# Altium schematic sheet Analog Interface.SchDoc
size A4; Author: Esteban Durán Madrid; CompanyName: Universidad de Santiago de Chile; Address1: Avenida Ecuador Nº 3519; Address2: Estación Central, Santiago; Address3: Chile; DocumentNumber: 4; SheetNumber: 4; SheetTotal: 5
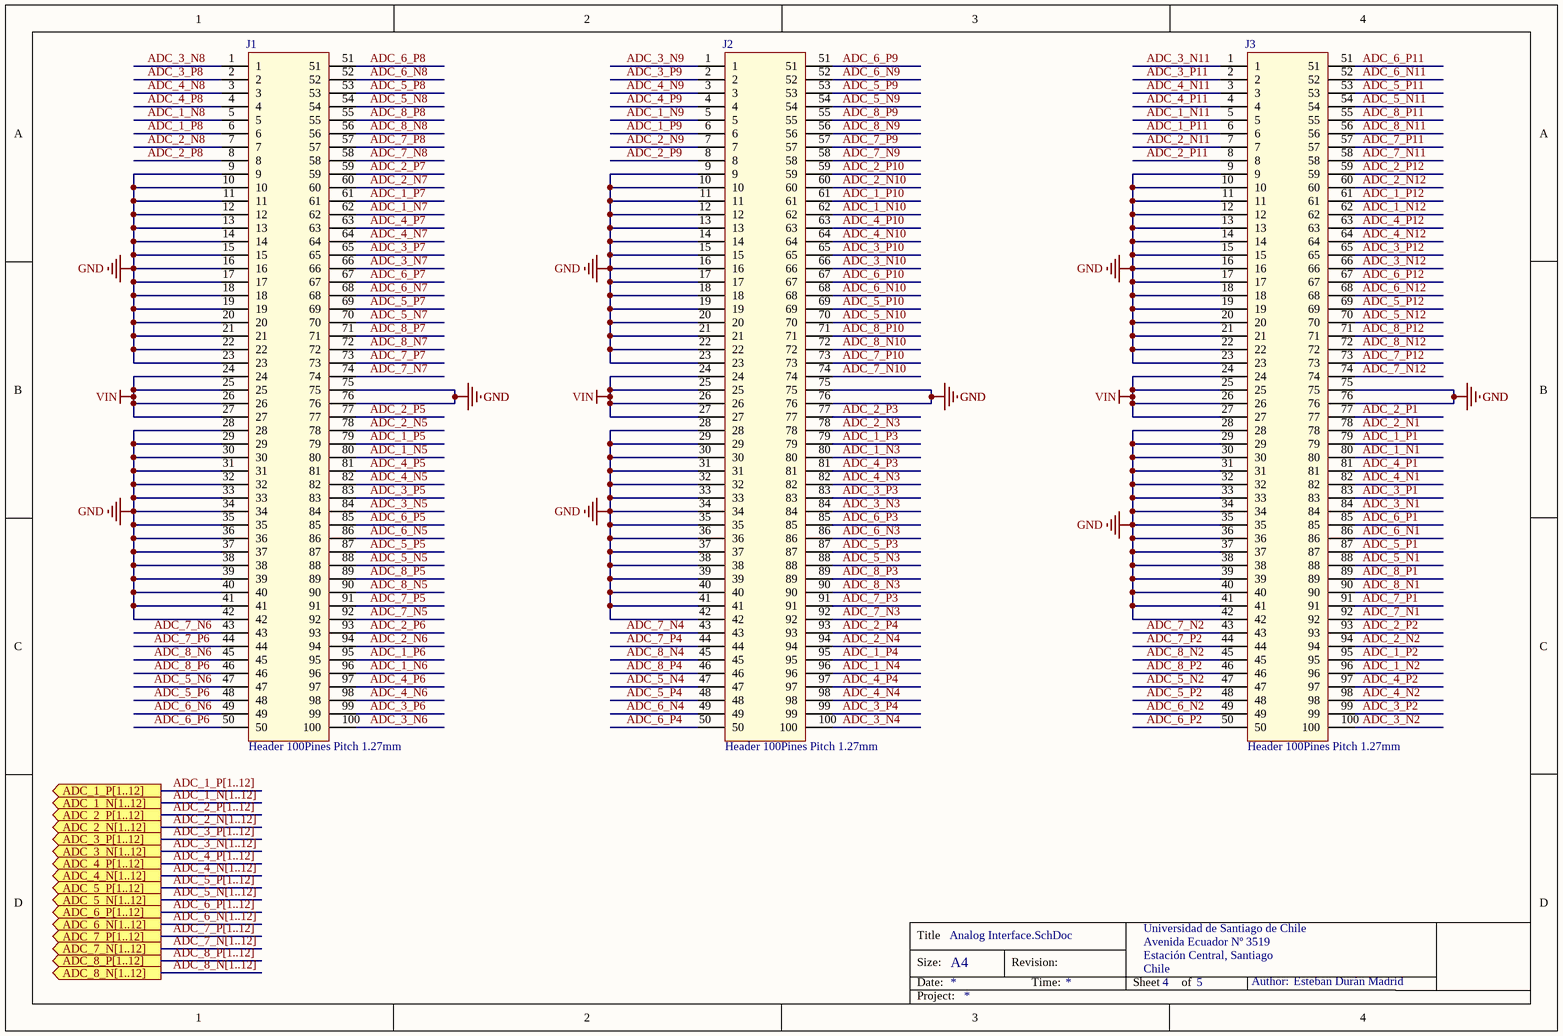
[diagram p0: Analog Interface.SchDoc]

## Parts
J1  Header 100Pines Pitch 1.27mm  [Conector TE 100pines (2 filas) Pitch: 1.27mm]
J2  Header 100Pines Pitch 1.27mm  [Conector TE 100pines (2 filas) Pitch: 1.27mm]
J3  Header 100Pines Pitch 1.27mm  [Conector TE 100pines (2 filas) Pitch: 1.27mm]

## Ports
ADC_1_N[1..12] (out), ADC_1_P[1..12] (out), ADC_2_N[1..12] (out), ADC_2_P[1..12] (out), ADC_3_N[1..12] (out), ADC_3_P[1..12] (out), ADC_4_N[1..12] (out), ADC_4_P[1..12] (out), ADC_5_N[1..12] (out), ADC_5_P[1..12] (out), ADC_6_N[1..12] (out), ADC_6_P[1..12] (out), ADC_7_N[1..12] (out), ADC_7_P[1..12] (out), ADC_8_N[1..12] (out), ADC_8_P[1..12] (out)

## Nets
GND: J1.9 J1.10 J1.11 J1.12 J1.13 J1.14 J1.15 J1.16 J1.17 J1.18 J1.19 J1.20 J1.21 J1.22 J1.23 J1.28 J1.29 J1.30 J1.31 J1.32 J1.33 J1.34 J1.35 J1.36 J1.37 J1.38 J1.39 J1.40 J1.41 J1.42 J1.75 J1.76 J2.9 J2.10 J2.11 J2.12 J2.13 J2.14 J2.15 J2.16 J2.17 J2.18 J2.19 J2.20 J2.21 J2.22 J2.23 J2.28 J2.29 J2.30 J2.31 J2.32 J2.33 J2.34 J2.35 J2.36 J2.37 J2.38 J2.39 J2.40 J2.41 J2.42 J2.75 J2.76 J3.9 J3.10 J3.11 J3.12 J3.13 J3.14 J3.15 J3.16 J3.17 J3.18 J3.19 J3.20 J3.21 J3.22 J3.23 J3.28 J3.29 J3.30 J3.31 J3.32 J3.33 J3.34 J3.35 J3.36 J3.37 J3.38 J3.39 J3.40 J3.41 J3.42 J3.75 J3.76
VIN: J1.24 J1.25 J1.26 J1.27 J2.24 J2.25 J2.26 J2.27 J3.24 J3.25 J3.26 J3.27
ADC_1_N1: J3.80
ADC_1_N2: J3.96
ADC_1_N3: J2.80
ADC_1_N4: J2.96
ADC_1_N5: J1.80
ADC_1_N6: J1.96
ADC_1_N7: J1.62
ADC_1_N8: J1.5
ADC_1_N9: J2.5
ADC_1_N10: J2.62
ADC_1_N11: J3.5
ADC_1_N12: J3.62
ADC_1_P1: J3.79
ADC_1_P2: J3.95
ADC_1_P3: J2.79
ADC_1_P4: J2.95
ADC_1_P5: J1.79
ADC_1_P6: J1.95
ADC_1_P7: J1.61
ADC_1_P8: J1.6
ADC_1_P9: J2.6
ADC_1_P10: J2.61
ADC_1_P11: J3.6
ADC_1_P12: J3.61
ADC_2_N1: J3.78
ADC_2_N2: J3.94
ADC_2_N3: J2.78
ADC_2_N4: J2.94
ADC_2_N5: J1.78
ADC_2_N6: J1.94
ADC_2_N7: J1.60
ADC_2_N8: J1.7
ADC_2_N9: J2.7
ADC_2_N10: J2.60
ADC_2_N11: J3.7
ADC_2_N12: J3.60
ADC_2_P1: J3.77
ADC_2_P2: J3.93
ADC_2_P3: J2.77
ADC_2_P4: J2.93
ADC_2_P5: J1.77
ADC_2_P6: J1.93
ADC_2_P7: J1.59
ADC_2_P8: J1.8
ADC_2_P9: J2.8
ADC_2_P10: J2.59
ADC_2_P11: J3.8
ADC_2_P12: J3.59
ADC_3_N1: J3.84
ADC_3_N2: J3.100
ADC_3_N3: J2.84
ADC_3_N4: J2.100
ADC_3_N5: J1.84
ADC_3_N6: J1.100
ADC_3_N7: J1.66
ADC_3_N8: J1.1
ADC_3_N9: J2.1
ADC_3_N10: J2.66
ADC_3_N11: J3.1
ADC_3_N12: J3.66
ADC_3_P1: J3.83
ADC_3_P2: J3.99
ADC_3_P3: J2.83
ADC_3_P4: J2.99
ADC_3_P5: J1.83
ADC_3_P6: J1.99
ADC_3_P7: J1.65
ADC_3_P8: J1.2
ADC_3_P9: J2.2
ADC_3_P10: J2.65
ADC_3_P11: J3.2
ADC_3_P12: J3.65
ADC_4_N1: J3.82
ADC_4_N2: J3.98
ADC_4_N3: J2.82
ADC_4_N4: J2.98
ADC_4_N5: J1.82
ADC_4_N6: J1.98
ADC_4_N7: J1.64
ADC_4_N8: J1.3
ADC_4_N9: J2.3
ADC_4_N10: J2.64
ADC_4_N11: J3.3
ADC_4_N12: J3.64
ADC_4_P1: J3.81
ADC_4_P2: J3.97
ADC_4_P3: J2.81
ADC_4_P4: J2.97
ADC_4_P5: J1.81
ADC_4_P6: J1.97
ADC_4_P7: J1.63
ADC_4_P8: J1.4
ADC_4_P9: J2.4
ADC_4_P10: J2.63
ADC_4_P11: J3.4
ADC_4_P12: J3.63
ADC_5_N1: J3.88
ADC_5_N2: J3.47
ADC_5_N3: J2.88
ADC_5_N4: J2.47
ADC_5_N5: J1.88
ADC_5_N6: J1.47
ADC_5_N7: J1.70
ADC_5_N8: J1.54
ADC_5_N9: J2.54
ADC_5_N10: J2.70
ADC_5_N11: J3.54
ADC_5_N12: J3.70
ADC_5_P1: J3.87
ADC_5_P2: J3.48
ADC_5_P3: J2.87
ADC_5_P4: J2.48
ADC_5_P5: J1.87
ADC_5_P6: J1.48
ADC_5_P7: J1.69
ADC_5_P8: J1.53
ADC_5_P9: J2.53
ADC_5_P10: J2.69
ADC_5_P11: J3.53
ADC_5_P12: J3.69
ADC_6_N1: J3.86
ADC_6_N2: J3.49
ADC_6_N3: J2.86
ADC_6_N4: J2.49
ADC_6_N5: J1.86
ADC_6_N6: J1.49
ADC_6_N7: J1.68
ADC_6_N8: J1.52
ADC_6_N9: J2.52
ADC_6_N10: J2.68
ADC_6_N11: J3.52
ADC_6_N12: J3.68
ADC_6_P1: J3.85
ADC_6_P2: J3.50
ADC_6_P3: J2.85
ADC_6_P4: J2.50
ADC_6_P5: J1.85
ADC_6_P6: J1.50
ADC_6_P7: J1.67
ADC_6_P8: J1.51
ADC_6_P9: J2.51
ADC_6_P10: J2.67
ADC_6_P11: J3.51
ADC_6_P12: J3.67
ADC_7_N1: J3.92
ADC_7_N2: J3.43
ADC_7_N3: J2.92
ADC_7_N4: J2.43
ADC_7_N5: J1.92
ADC_7_N6: J1.43
ADC_7_N7: J1.74
ADC_7_N8: J1.58
ADC_7_N9: J2.58
ADC_7_N10: J2.74
ADC_7_N11: J3.58
ADC_7_N12: J3.74
ADC_7_P1: J3.91
ADC_7_P2: J3.44
ADC_7_P3: J2.91
ADC_7_P4: J2.44
ADC_7_P5: J1.91
ADC_7_P6: J1.44
ADC_7_P7: J1.73
ADC_7_P8: J1.57
ADC_7_P9: J2.57
ADC_7_P10: J2.73
ADC_7_P11: J3.57
ADC_7_P12: J3.73
ADC_8_N1: J3.90
ADC_8_N2: J3.45
ADC_8_N3: J2.90
ADC_8_N4: J2.45
ADC_8_N5: J1.90
ADC_8_N6: J1.45
ADC_8_N7: J1.72
ADC_8_N8: J1.56
ADC_8_N9: J2.56
ADC_8_N10: J2.72
ADC_8_N11: J3.56
ADC_8_N12: J3.72
ADC_8_P1: J3.89
ADC_8_P2: J3.46
ADC_8_P3: J2.89
ADC_8_P4: J2.46
ADC_8_P5: J1.89
ADC_8_P6: J1.46
ADC_8_P7: J1.71
ADC_8_P8: J1.55
ADC_8_P9: J2.55
ADC_8_P10: J2.71
ADC_8_P11: J3.55
ADC_8_P12: J3.71

## Buses and harness runs
bus ADC_1_N[1..12] = port ADC_1_N[1..12]
bus ADC_1_P[1..12] = port ADC_1_P[1..12]
bus ADC_2_N[1..12] = port ADC_2_N[1..12]
bus ADC_2_P[1..12] = port ADC_2_P[1..12]
bus ADC_3_N[1..12] = port ADC_3_N[1..12]
bus ADC_3_P[1..12] = port ADC_3_P[1..12]
bus ADC_4_N[1..12] = port ADC_4_N[1..12]
bus ADC_4_P[1..12] = port ADC_4_P[1..12]
bus ADC_5_N[1..12] = port ADC_5_N[1..12]
bus ADC_5_P[1..12] = port ADC_5_P[1..12]
bus ADC_6_N[1..12] = port ADC_6_N[1..12]
bus ADC_6_P[1..12] = port ADC_6_P[1..12]
bus ADC_7_N[1..12] = port ADC_7_N[1..12]
bus ADC_7_P[1..12] = port ADC_7_P[1..12]
bus ADC_8_N[1..12] = port ADC_8_N[1..12]
bus ADC_8_P[1..12] = port ADC_8_P[1..12]

## Notes on the sheet
- Title
- Size:
- Date:
- A4
- Revision:
- Time:
- Sheet
- of
- Author:
- Project:

## Library data of the parts
J1-J3 = Header 100Pines Pitch 1.27mm: 6-104068-7; Digikey Part-Number: A33560-ND; Manufacturer Part-Number: 6-104068-7